# EAGLE design DC24_HHV_RE-revA (EAGLE 6.5.0)
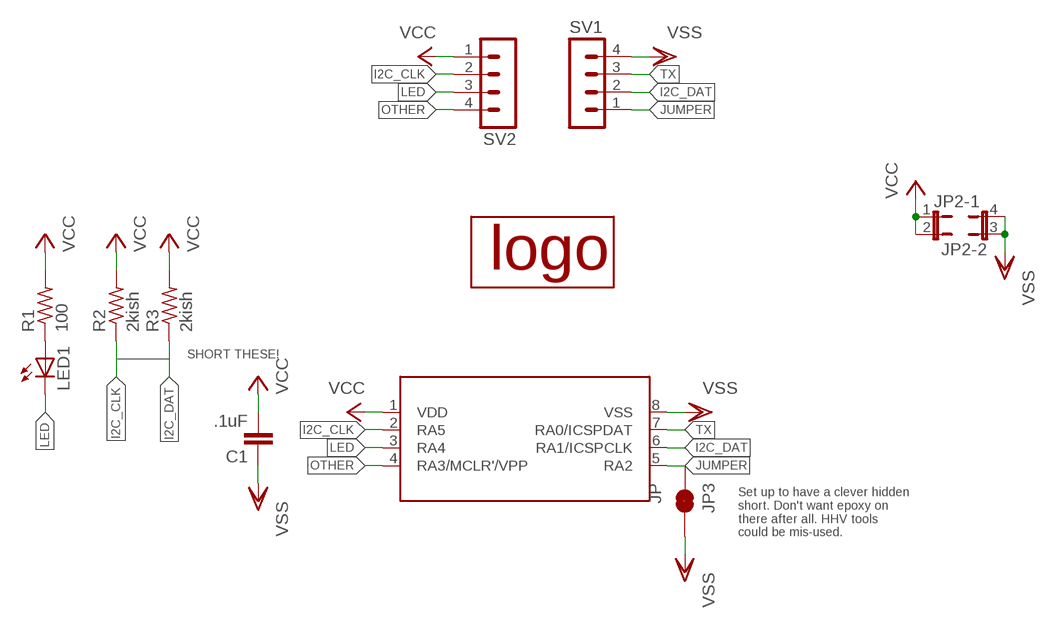
[diagram p0: schematic, sheet 1]

## Parts
C1  .1uF  C-EU050-024X044  [C050-024X044]
JP2  JP2QE  [JP2Q]
JP3  JP  JUMPER-PAD-2-NC_BY_TRACE  [PAD-JUMPER-2-NC_BY_TRACE_YES_SILK]
LED1  LED5MM  [LED5MM]
R1  100  R-US_0204/7  [0204/7]
R2  2kish  R-US_0204/7  [0204/7]
R3  2kish  R-US_0204/7  [0204/7]
SV1  MA04-1  [MA04-1]
SV2  MA04-1  [MA04-1]
U1  PIC12F1571  [DIL8]
U$1  KBELOGO-SILK  [KBELOGO-SILK]

## Nets
I2C_CLK: R2.1 SV2.2 U1.2(RA5)
I2C_DAT: R3.1 SV1.2 U1.6(RA1/ICSPCLK)
JUMPER: JP3.1 SV1.1 U1.5(RA2)
LED: LED1.K(C) SV2.3 U1.3(RA4)
N$3: LED1.A R1.1
OTHER: SV2.4 U1.4(RA3/MCLR'/VPP)
TX: SV1.3 U1.7(RA0/ICSPDAT)
VCC: C1.2 JP2.1 JP2.2 R1.2 R2.2 R3.2 SV2.1 U1.1(VDD)
VSS: C1.1 JP2.3 JP2.4 JP3.2 SV1.4 U1.8(VSS)

## Notes on the sheet
- SHORT THESE!
- Set up to have a clever hidden
  short. Don't want epoxy on
  there after all. HHV tools
  could be mis-used.

## Library data of the parts
C1 = rcl:C-EU: CAPACITOR, European symbol
JP2 = jumper:JP2QE: JUMPER
JP3 = SparkFun-Passives:JUMPER-PAD-2-NC_BY_TRACE
LED1 = led:LED: LED OSRAM: - CHIPLED LG R971, LG N971, LY N971, LG Q971, LY Q971, LO R971, LY R971 LH N974, LH R974 LS Q976, LO Q976, LY Q976 LO Q996 - Hyper CHIPLED LW Q18S LB Q993, LB Q99A, LB R99A - SideLED LS A670, LO A670, LY A670, LG A670, LP A670 LB A673, LV A673, LT A673, LW A673 LH A674 LY A675 LS A676, LA A676, LO A676, LY A676, LW A676 LS A679, LY A679, LG A679 - Hyper Micro SIDELED® LS Y876, LA Y876, LO Y876, LY Y876 LT Y87S - SmartLED LW L88C, LW L88S LB L89C, LB L89S, LG L890 LS L89K, LO L89K, LY L89K LS L896, LA L896, LO L896, LY L896 - TOPLED LS T670, LO T670, LY T670, LG T670, LP T670 LSG T670, LSP T670, LSY T670, LOP T670, LYG T670 LG T671, LOG T671, LSG T671 LB T673, LV T673, LT T673, LW T673 LH T674 LS T676, LA T676, LO T676, LY T676, LB T676, LH T676, LSB T676, LW T676 LB T67C, LV T67C, LT T67C, LS T67K, LO T67K, LY T67K, LW E67C LS E67B, LA E67B, LO E67B, LY E67B, LB E67C, LV E67C, LT E67C LW T67C LS T679, LY T679, LG T679 LS T770, LO T770, LY T770, LG T770, LP T770 LB T773, LV T773, LT T773, LW T773 LH T774 LS E675, LA E675, LY E675, LS T675 LS T776, LA T776, LO T776, LY T776, LB T776 LHGB T686 LT T68C, LB T68C - Hyper Mini TOPLED® LB M676 - Mini TOPLED Santana® LG M470 LS M47K, LO M47K, LY M47K Source: http://www.osram.convergy.de LUXEON: - LUMILED® LXK2-PW12-R00, LXK2-PW12-S00, LXK2-PW14-U00, LXK2-PW14-V00 LXK2-PM12-R00, LXK2-PM12-S00, LXK2-PM14-U00 LXK2-PE12-Q00, LXK2-PE12-R00, LXK2-PE12-S00, LXK2-PE14-T00, LXK2-PE14-U00 LXK2-PB12-K00, LXK2-PB12-L00, LXK2-PB12-M00, LXK2-PB14-N00, LXK2-PB14-P00, LXK2-PB14-Q00 LXK2-PR12-L00, LXK2-PR12-M00, LXK2-PR14-Q00, LXK2-PR14-R00 LXK2-PD12-Q00, LXK2-PD12-R00, LXK2-PD12-S00 LXK2-PH12-R00, LXK2-PH12-S00 LXK2-PL12-P00, LXK2-PL12-Q00, LXK2-PL12-R00 Source: www.luxeon.com KINGBRIGHT: KA-3528ASYC Source: www.kingbright.com
R1-R3 = rcl:R-US_: RESISTOR, American symbol
SV1 SV2 = con-lstb:MA04-1: PIN HEADER; OC_FARNELL: unknown; OC_NEWARK: unknown
U1 = cuslibrary:PIC12F1571
U$1 = cuslibrary:KBELOGO-SILK

## Board
DC24 HHV Reverse Engineering Challenge
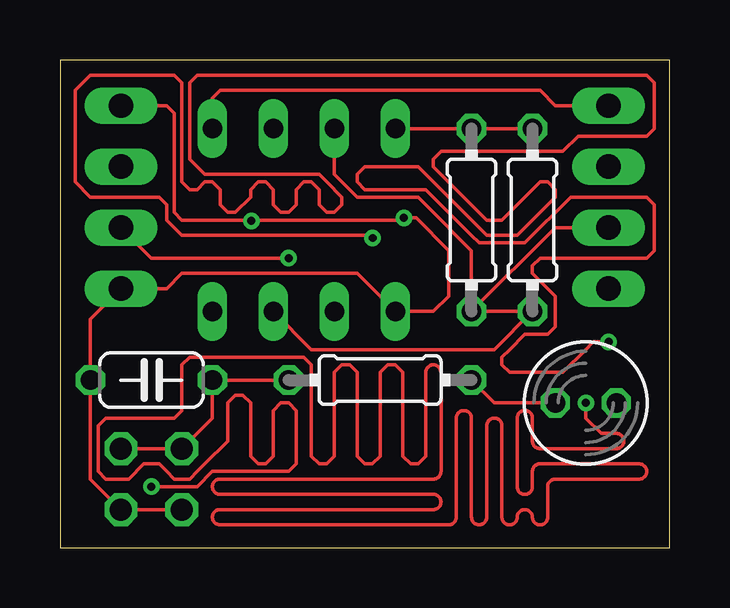
[diagram p1: board, top side]
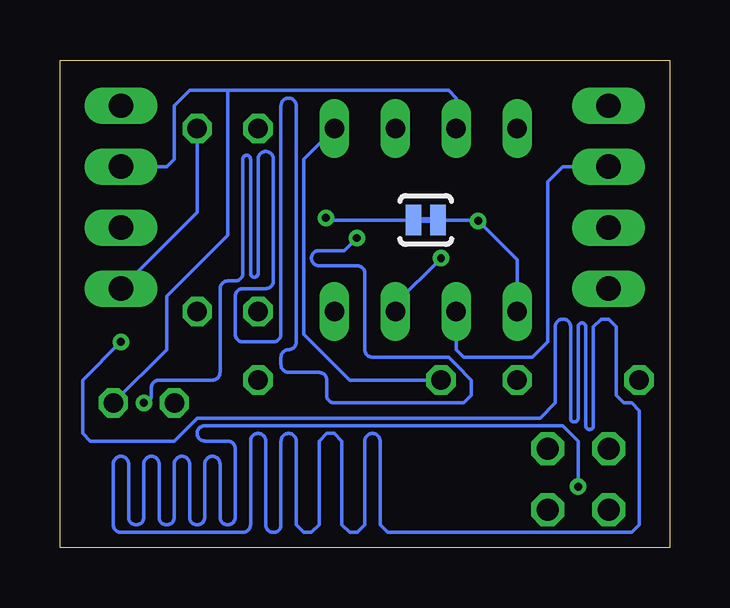
[diagram p2: board, bottom side, seen from below]

Size 25.4 x 20.32 mm. Coordinates in mm from the lower left corner, seen from the top.
Outline: 0,0 25.4,0 25.4,20.32 0,20.32 0,0
Copper layers (1*16): Top 0.0356mm / dielectric 1.5011mm / Bottom 0.0356mm
Design rules "DC24_HHV_RE *": minimum track width 6mil, minimum drill 13mil, track to track 6mil, track to pad 6mil, pad to pad 6mil, via to via 6mil, smd to smd 6mil, copper to edge 15mil, drill to drill 6mil, minimum pad ring 7mil, minimum via ring 7mil, stop-mask expansion 3mil, vias tented up to drill 14mil, thermal gap 10mil

### Footprints (pad centres in the part's own frame; a part is rotated, then mirrored left to right if it is on the bottom)
C050-024X044 = drill 0.813 octagon: 1 -2.54,0; 2 2.54,0
JP2Q = drill 0.914 octagon: 1 -1.27,-1.27; 2 1.27,-1.27; 3 -1.27,1.27; 4 1.27,1.27
PAD-JUMPER-2-NC_BY_TRACE_YES_SILK = smd 0.635 x 1.27: 1 -0.508,0; 2 0.508,0
LED5MM = drill 0.813 octagon: A -1.27,0; K 1.27,0
0204/7 = drill 0.813 octagon: 1 -3.81,0; 2 3.81,0
MA04-1 = drill 1.016 long: 1 -3.81,0; 2 -1.27,0; 3 1.27,0; 4 3.81,0
DIL8 = drill 0.813 long: 1 -3.81,-3.81; 2 -1.27,-3.81; 3 1.27,-3.81; 4 3.81,-3.81; 5 3.81,3.81; 6 1.27,3.81; 7 -1.27,3.81; 8 -3.81,3.81

### Placement (x,y rotation side)
C1  3.81,6.99 0 top
JP2  3.81,2.86 180 top
JP3  10.16,13.65 180 bottom
LED1  21.91,6.03 0 top
R1  13.34,6.99 180 top
R2  17.14,13.65 90 top
R3  19.68,13.65 90 top
SV1  2.54,14.61 270 top
SV2  22.86,14.61 90 top
U1  10.16,13.65 180 top
U$1  5.71,11.75 0 top

### Tracks (layer width: path | path; a pad name or v marks a point on that pad's centre or on a via)
I2C_CLK
  Top 0.152: SV2.2 20.64,13.34 R2.1 17.14,12.38 15.24,14.29 14.92,14.61 12.38,14.61 11.43,15.56 U1.2
I2C_DAT
  Top 0.152: U1.6 10.48,8.26 11.11,8.26 18.1,8.26 R3.1 18.1,9.84 17.46,9.84
  Bottom 0.152: U1.6 8.89,8.26 8.57,7.94 5.71,7.94 5.08,8.57 5.08,14.61 5.08,15.24 4.45,15.88 SV1.2
JUMPER  (via drill 0.33)
  Top 0.152: 11.61,13.64 8,13.64 v7.98,13.61 7.94,13.65 5.08,13.65 4.76,13.97 4.76,18.1 4.45,18.41 3.17,18.41 SV1.1
  Bottom 0.152: JP3.1 8.01,13.65 v7.98,13.61 6.35,11.99 U1.5
LED
  Bottom 0.152: U1.3 8.89,18.73 9.21,19.05 18.41,19.05 | 18.41,19.05 20,19.05 20.64,18.41 20.64,16.19 20.95,15.88 SV2.3 | LED1.K 20.95,8.26 20.95,10.16 20.95,10.48 19.68,11.75 18.41,13.02 18.41,19.05
N$3
  Top 0.152: R1.1 18.1,6.03 LED1.A
N$4  (via drill 0.33)
  Top 0.152: v21.91,6.03 21.91,5.4 22.54,4.76 23.18,4.76 arc-180 23.18,4.13 20,4.13 arc-90 19.68,4.45 19.68,5.4 arc180 19.05,5.4 19.05,2.54 arc180 19.68,2.54 19.68,3.17 arc-90 20,3.49 24.13,3.49 arc-180 24.13,2.86 20.64,2.86 arc90 20.32,2.54 20.32,1.27 arc-90 20,0.95 arc-90 19.68,1.27 arc90 19.37,1.59 arc90 19.05,1.27 arc-90 18.73,0.95 arc-90 18.41,1.27 18.41,5.08 arc180 17.78,5.08 17.78,1.27 arc-180 17.14,1.27 17.14,5.4 arc180 16.51,5.4 16.51,1.27 arc-90 16.19,0.95 6.67,0.95 arc-180 6.67,1.59 15.56,1.59 arc180 15.56,2.22 6.67,2.22 arc-180 6.67,2.86 15.56,2.86 arc90 15.88,3.17 15.88,5.08 15.88,7.3 arc180 15.24,7.3 15.24,3.81 14.92,3.49 14.61,3.49 14.29,3.81 14.29,7.3 13.97,7.62 13.65,7.62 13.34,7.3 13.34,3.81 13.02,3.49 12.7,3.49 12.38,3.81 12.38,7.3 12.06,7.62 11.75,7.62 11.43,7.3 11.43,3.81 11.11,3.49 10.79,3.49 10.48,3.81 10.48,7.62 10.16,7.94 5.4,7.94 5.08,7.62 5.08,5.71 4.76,5.4 1.91,5.4 1.59,5.08 1.59,3.17 1.91,2.86 2.86,2.86 3.49,3.49 4.13,3.49 4.45,3.17 4.76,2.86 5.4,2.86 5.71,3.17 6.03,3.49 6.99,4.45 6.99,4.76 6.99,6.03 7.3,6.35 7.62,6.35 7.94,6.03 7.94,3.81 8.26,3.49 8.57,3.49 8.89,3.81 8.89,5.71 9.21,6.03 9.53,6.03 9.84,5.71 9.84,3.49 9.53,3.17 6.35,3.17 5.71,2.54 v3.81,2.54 | v22.86,8.57 22.23,8.57 21.91,8.26 20.95,7.3 18.73,7.3 18.41,7.62 18.41,7.94 18.73,8.26 19.37,8.89 20.32,8.89 20.64,9.21 20.64,10.48 20.32,10.79 19.68,11.43 19.68,11.75 20,12.06 24.13,12.06 24.45,12.06 24.77,12.38 24.77,14.29 24.45,14.61 21.27,14.61 19.37,12.7 17.46,12.7 17.14,13.02 15.24,14.92 12.7,14.92 12.38,15.24 12.38,15.56 12.7,15.88 14.92,15.88 16.19,14.61 17.78,13.02 19.05,13.02 20.64,14.61 20.64,14.92 20.32,15.24 20,15.24 19.68,14.92 18.41,13.65 17.78,13.65 17.14,14.29 15.56,15.88 15.56,16.19 15.88,16.51 19.68,16.51 20.95,16.51 21.59,17.14 24.45,17.14 24.77,17.46 24.77,19.05 24.77,19.37 24.45,19.68 5.71,19.68 5.4,19.37 5.4,16.19 6.03,15.56 10.79,15.56 11.11,15.24 11.75,14.61 11.75,14.29 11.43,13.97 11.11,13.97 10.79,14.29 10.79,14.61 10.79,14.92 10.48,15.24 10.16,15.24 9.84,14.92 9.84,14.61 9.84,14.29 9.53,13.97 9.21,13.97 8.89,14.29 8.89,14.92 8.57,15.24 8.26,15.24 7.94,14.92 7.94,14.61 7.3,13.97 6.99,13.97 6.67,14.29 6.67,14.61 6.67,14.92 6.35,15.24 6.03,15.24 5.71,14.92 5.4,14.92 5.08,15.24 5.08,19.37 4.76,19.68 1.27,19.68 0.95,19.37 0.64,19.05 0.64,15.24 1.27,14.61 4.13,14.61 4.45,14.29 4.45,13.65 5.08,13.02 9.21,13.02 12.06,13.02 12.92,13.02 v13.03,12.9
  Bottom 0.152: v3.81,2.54 3.81,4.45 4.45,5.08 6.99,5.08 9.84,5.08 19.37,5.08 arc-180 19.37,4.45 18.41,4.45 arc90 18.1,4.13 18.1,1.27 arc180 18.73,1.27 18.73,3.49 arc-180 19.37,3.49 19.37,1.27 arc180 20,1.27 20,3.49 arc-180 20.64,3.49 20.64,1.27 arc180 21.27,1.27 21.27,3.49 arc-180 21.91,3.49 21.91,1.27 arc180 22.54,1.27 22.54,3.49 arc-180 23.18,3.49 23.18,0.95 arc-90 22.86,0.64 17.78,0.64 arc-90 17.46,0.95 17.46,4.45 arc180 16.83,4.45 16.83,0.95 arc-180 16.19,0.95 16.19,4.45 arc180 15.56,4.45 15.56,0.95 15.24,0.64 14.92,0.64 14.61,0.95 14.61,4.45 14.29,4.76 13.97,4.76 13.65,4.45 13.65,0.95 13.34,0.64 13.02,0.64 12.7,0.95 12.7,1.27 12.7,4.45 arc180 12.06,4.45 12.06,0.95 11.75,0.64 1.59,0.64 1.27,0.95 1.27,5.71 1.59,6.03 1.91,6.03 2.22,6.35 2.22,9.21 2.54,9.53 2.86,9.53 3.17,9.21 3.17,8.89 3.17,6.03 3.17,5.08 arc180 3.49,5.08 3.49,9.21 arc-180 3.81,9.21 3.81,5.4 arc180 4.13,5.4 4.13,9.21 arc-180 4.76,9.21 4.76,6.03 5.4,5.4 19.68,5.4 20,5.08 20.64,4.45 21.27,4.45 24.13,4.45 24.45,4.76 24.45,6.99 v22.86,8.57 | v13.03,12.9 13.55,12.38 13.65,12.38 14.29,12.38 14.61,12.38 arc-180 14.61,11.75 13.02,11.75 arc90 12.7,11.43 12.7,8.26 arc-90 12.38,7.94 9.21,7.94 8.89,7.62 8.26,6.99 8.26,6.35 8.57,6.03 8.89,6.03 13.97,6.03 arc90 14.29,6.35 14.29,6.99 arc-90 14.61,7.3 15.88,7.3 arc90 16.19,7.62 16.19,7.94 arc90 15.88,8.26 arc-90 15.56,8.57 15.56,18.41 arc-180 16.19,18.41 16.19,8.89 arc90 16.51,8.57 17.46,8.57 17.78,8.57 arc90 18.1,8.89 18.1,10.48 arc90 17.78,10.79 16.83,10.79 arc-90 16.51,11.11 16.51,16.19 arc-180 17.14,16.19 17.14,11.43 arc180 17.46,11.43 17.46,16.19 arc-180 17.78,16.19 17.78,11.43 arc90 18.1,11.11 18.41,11.11 arc-90 18.73,10.79 18.73,7.3 arc90 19.05,6.99 21.27,6.99 arc-90 21.59,6.67 21.59,6.35 arc90 v21.91,6.03
OTHER
  Top 0.152: U1.4 6.35,18.73 6.67,19.05 20,19.05 20.64,18.41 SV2.4
TX  (via drill 0.33)
  Top 0.152: v9.53,12.06 3.81,12.06 SV1.3
  Bottom 0.152: U1.7 11.43,10.16 v9.53,12.06
VCC
  Top 0.152: R1.2 C1.2 6.35,5.4 JP2.1 JP2.2 | R2.2 R3.2 U1.1
  Bottom 0.152: R3.2 19.68,14.29 19.68,13.97 SV2.1 | R1.2 13.34,6.99 15.24,8.89 15.24,16.19 U1.1
VSS  (via drill 0.33)
  Top 0.152: 11.61,13.64 14.2,13.64 14.22,13.64 v14.33,13.74 14.83,13.74 16.19,12.38 16.19,10.48 15.56,9.84 U1.8 12.38,11.43 9.21,11.43 5.08,11.43 4.45,10.79 SV1.4 1.27,9.53 C1.1 1.27,2.86 JP2.4 JP2.3
  Bottom 0.152: JP3.2 14.21,13.65 14.24,13.65 v14.33,13.74

### Text on the board
tTest: www.KBEmbedded.com | CR2025 | + | Rev. A | - | DC24 HHV RE Challenge
bTest: Me | Open